# Altium schematic sheet 555timer.SchDoc
size A4; SheetNumber: 1; SheetTotal: 2
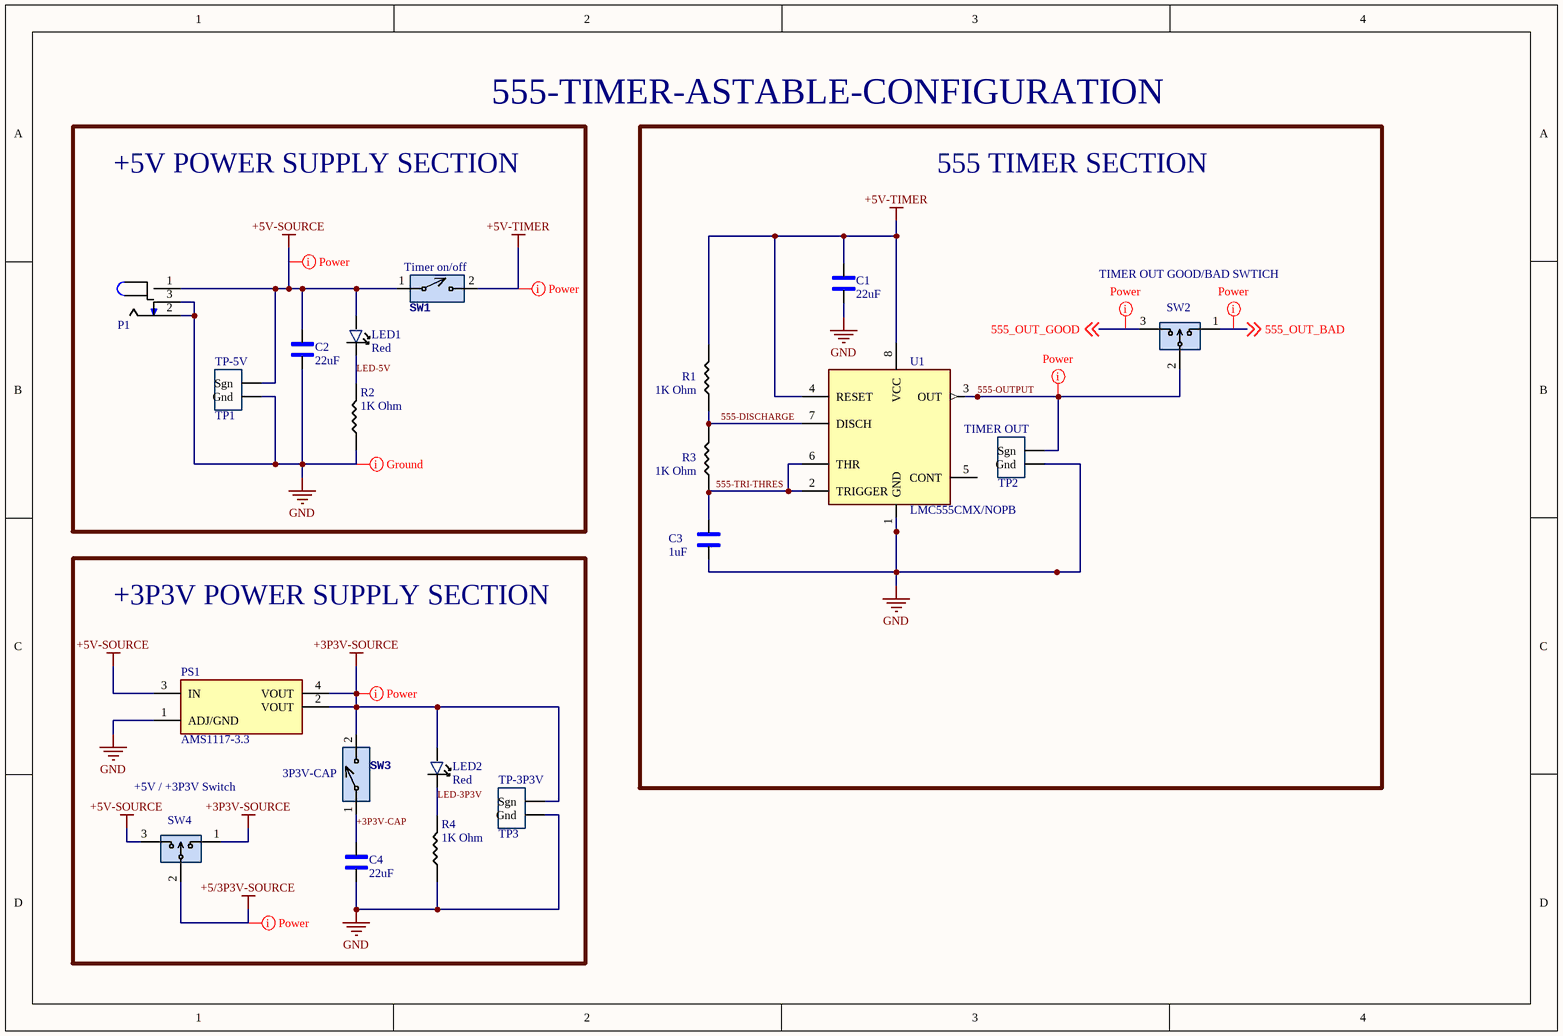
[diagram p0: 555timer.SchDoc]

## Parts
C1  22uF  [1206_Passive_Capacitor]
C2  22uF  [1206_Passive_Capacitor]
C3  1uF  [1206_Passive_Capacitor]
C4  22uF  [1206_Passive_Capacitor]
LED1  Red  [LED_1206]
LED2  Red  [LED_1206]
P1  Power Jack  [Power_Jack]  (value not drawn)
PS1  AMS1117-3.3  [LDO]
R1  value 1K Ohm  [1206_Passive_Resitor]  (hidden comment: 1k)
R2  value 1K Ohm  [1206_Passive_Resitor]  (hidden comment: 1k)
R3  value 1K Ohm  [1206_Passive_Resitor]  (hidden comment: 1k)
R4  value 1K Ohm  [1206_Passive_Resitor]  (hidden comment: 1k)
SW1  SW_2Pin_100mil_Switch  [2Pin-Header-Conn]  (value not drawn)
SW2  PREC003SAAN-RC  [3_PIN_100mil]  (value not drawn)
SW3  SW_2Pin_100mil_Switch  [2Pin-Header-Conn]  (value not drawn)
SW4  PREC003SAAN-RC  [3_PIN_100mil]  (value not drawn)
TP1  TP-5V  [TP10x_Probe]
TP2  TIMER OUT  [TP10x_Probe]
TP3  TP-3P3V  [TP10x_Probe]
U1  LMC555CMX/NOPB  [TS555IDTTR]

## Blocks framed on the sheet
555-TIMER-ASTABLE-CONFIGURATION: C2 LED1 P1 R2 SW1 TP1
555 TIMER SECTION: C1 C3 R1 R3 SW2 TP2 U1
+3P3V POWER SUPPLY SECTION: C4 LED2 PS1 R4 SW3 SW4 TP3

## Nets
+3P3V-SOURCE: LED2.1 PS1.2(VOUT) PS1.4(VOUT) SW3.2 SW4.1 TP3.1(Sgn)
+5/3P3V-SOURCE: SW4.2
+5V-SOURCE: C2.2 LED1.1 P1.1 PS1.3(IN) SW1.1 SW4.3 TP1.1(Sgn)
+5V-TIMER: C1.2 R1.2 SW1.2 U1.4(RESET) U1.8(VCC)
GND: C1.1 C2.1 C3.1 C4.1 P1.2 P1.3 PS1.1(ADJ/GND) R2.1 R4.1 TP1.2(Gnd) TP2.2(Gnd) TP3.2(Gnd) U1.1(GND)
555-DISCHARGE: R1.1 R3.2 U1.7(DISCH)
555-OUTPUT: SW2.2 TP2.1(Sgn) U1.3(OUT)
555-TRI-THRES: C3.2 R3.1 U1.2(TRIGGER) U1.6(THR)
555_OUT_BAD: SW2.1 ; off-sheet 555_OUT_BAD
555_OUT_GOOD: SW2.3 ; off-sheet 555_OUT_GOOD
+3P3V-CAP: C4.2 SW3.1
LED-3P3V: LED2.2 R4.2
LED-5V: LED1.2 R2.2

Not connected (* = marked no-connect by the designer): U1 5(CONT)

## Layout directives
rule Width Constraint [Pref Width = 20mil    Min Width = 15mil    Max Width = 100mil]: 555-OUTPUT, 555_OUT_BAD, 555_OUT_GOOD, +3P3V-SOURCE, +5/3P3V-SOURCE, +5V-SOURCE, +5V-TIMER, GND

## Notes on the sheet
- +5V POWER SUPPLY SECTION
- (near SW1) Timer on/off
- (near SW2) TIMER OUT GOOD/BAD SWTICH
- +5V / +3P3V Switch
- (near SW3) 3P3V-CAP

## Library data of the parts
C1 C2 C4 = C_22uF_1206: 22uF ±10% 25V X5R 1206 Multilayer Ceramic Capacitors MLCC - SMD/SMT RoHS; MFR Part #: CL31A226KAHNNNE; Type: basic; LCSC Part#: C12891; Datasheet: https://datasheet.lcsc.com/lcsc/1811031514_Samsung-Electro-Mechanics-CL31A226KAHNNNE_C12891.pdf; Value: 22uF
C3 = C_1uF_1206: MULTILAYER CERAMIC CAPACITORS MLCC - SMD/SMT 1UF 50V 1206 ROHS; MFR Part #: CL31B105KBHNNNE; Type: Basic; Digikey Link: https://www.digikey.com/product-detail/en/C1206C105M4RACTU/399-8150-1-ND/3471873/?itemSeq=304982366; LCSC Part#: C1848; Value: 1uF
LED1 LED2 = LED_RED_1206: Red 621~631nm 1206 Light Emitting Diodes (LED) RoHS; MFR Part #: 15-21/R6C-FQ1R1B/2T; Type: Extended; LCSC Part#: C93133; Datasheet: https://datasheet.lcsc.com/szlcsc/1811151241_Everlight-Elec-15-21-R6C-FQ1R1B-2T_C93133.pdf; Value: Red
P1 = P_Power Jack: Power Barrel Connector Jack 2.10mm ID (0.083"), 5.50mm OD (0.217") Through Hole, Right Angle; MFR Part #: PJ-102A; Value: CONN PWR JACK 2X5.5MM SOLDER; Digikey Link: https://www.digikey.com/product-detail/en/PJ-102A/CP-102A-ND/275425/?itemSeq=304982367; LCSC Part#: C136744; Type: Extended
PS1 = PS_AMS_LDO_3v3: LOW DROPOUT REGULATORS(LDO) POSITIVE FIXED 1.3V @ 800MA 15V 3.3V 1A SOT-223 ROHS; Value: IC REG LINEAR 3.3V 800MA SOT223; MFR Part #: AMS1117-3.3; LCSC Part#: C6186; Type: Basic
R1-R4 = R_1K_1206: CHIP RESISTOR - SURFACE MOUNT 1KOHMS ±1% 1/4W 1206 ROHS; MFR Part #: RNCP1206FTD1K00CT; Digikey Link: https://www.digikey.com/product-detail/en/RNCP1206FTD1K00/RNCP1206FTD1K00CT-ND/2240675/?itemSeq=304982373; LCSC Part#: C4410; Type: Basic
SW1 SW3 = SW_2Pin_100mil_Switch: 2Pin Header; LCSC Part#: C124375; Type: Extended
SW2 SW4 = SW_3Pin_100mil_Switch: Connector Header Through Hole 3 position 0.100" (2.54mm); Value: CONN HEADER VERT 3POS 2.54MM; Digikey Link: https://www.digikey.com/product-detail/en/PREC003SAAN-RC/S1012EC-03-ND/2774851/?itemSeq=304982371; MFR Part #: PREC003SAAN-RC; Type: Extended; LCSC Part#: C49257
TP1-TP3 = TP_10x_Probe: Test Point 300 mil centers
U1 = U_555_Fast: 555 Type, Timer/Oscillator _Single_ IC 3MHz 8-SO; Package: SOIC-8; MFR Part #: LMC555CMX/NOPB; DigiKey link: https://www.digikey.com/product-detail/en/texas-instruments/LMC555CMX-NOPB/LMC555CMX-NOPBCT-ND/1010550; LCSC Part#: C90760; Type: Extended